# Altium schematic sheet DISPLAY.SchDoc
size A4; SheetNumber: 6; SheetTotal: 8
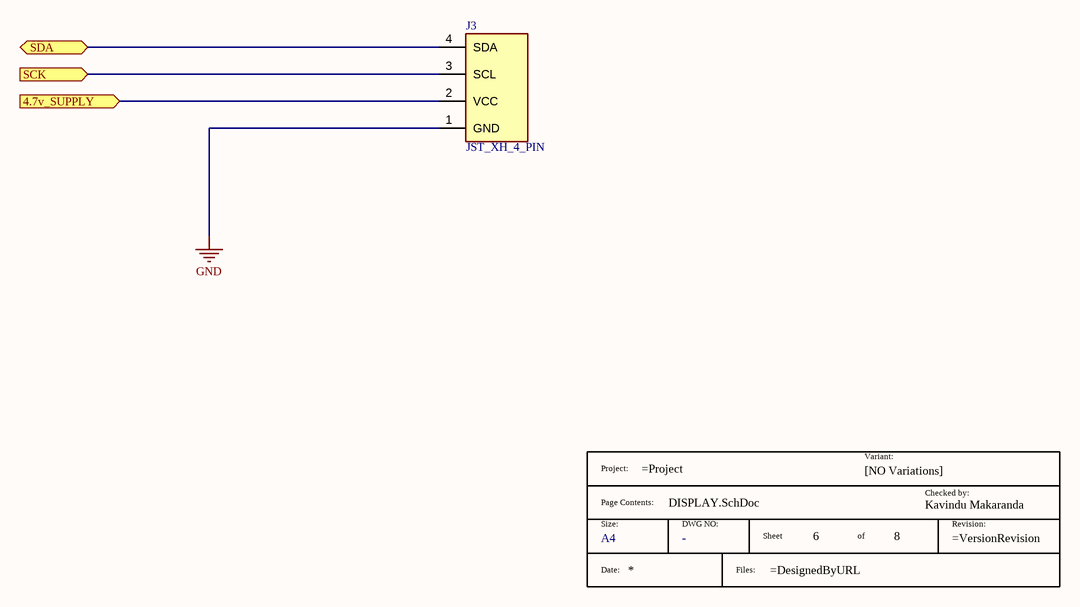
[diagram p0: DISPLAY.SchDoc]

## Parts
*?  Size: A4  (hidden comment: TitleBlock)  (graphical)
J3  JST_XH_4_PIN  [B4BXHALFSN]

## Ports
4.7v_SUPPLY (in, see Main_sch[2C], FUEL GAUGE IC[1B], MCU[3A], VOLTAGE REGULATOR[3B]), SCK (in, see Main_sch[3C], FUEL GAUGE IC[1B], MCU[1B]), SDA (bidir, see Main_sch[3C], FUEL GAUGE IC[1B], MCU[1B])

## Nets
GND: J3.1(GND)
4.7v_SUPPLY: J3.2(VCC) ; port 4.7v_SUPPLY
SCK: J3.3(SCL) ; port SCK
SDA: J3.4(SDA) ; port SDA

## Notes on the sheet
- THIS DOCUMENT AND THE DATA DISCLOSED HEREIN OR
- HEREWITH IS THE PROPERTY OF ALTIUM LIMITED AND MAY
- DWG NO:
- REVISION
- REV:
- DESCRIPTION
- DATE
- APPROVED
- BE FREELY DISTRIBUTED IN WHOLE. NO RIGHTS ARE
- RESERVED OR EXPRESS OR IMPLIED WARANTEE GIVEN.
- ENG:
- APPROVALS
- PROJECT
- DSN:
- CHK:
- REFERENCE DOCUMENTS
- PROJECT REVISION:
- TITLE
- DOCUMENT REVISION:
- DESIGN ITEM:
- BOM:
- FAB DWG:
- PCB DWG:
- ASSY DWG:
- SCALE:
- A3
- SIZE
- CAGE CODE
- FILE NAME
- DWG NO.
- SHEET
- OF
- REV
- (in symbol TitleBlock) Project:; Variant:; [NO Variations]; Checked by:; Page Contents:; Kavindu Makaranda; Size:; DWG NO:; Sheet; of; Revision:; Date:; Files:

## Library data of the parts
*? = TitleBlock: Standard Title Block; DWG NO: -
J3 = B4B-XH-A_LF__SN_: Connector; Manufacturer_Name: JST (JAPAN SOLDERLESS TERMINALS); Manufacturer_Part_Number: B4B-XH-A(LF)(SN); Datasheet Link: https://datasheet.lcsc.com/szlcsc/JST-Sales-America-B4B-XH-A-LF-SN_C144395.pdf; Height: 7mm; Mouser Part Number: 306-B4BXHALFSN; Mouser Price/Stock: https://www.mouser.co.uk/ProductDetail/JST-Commercial/B4B-XH-ALFSN?qs=cdbOS8ANM9CfC08d%252BywhFw%3D%3D; Arrow Part Number: B4B-XH-A(LF)(SN); Arrow Price/Stock: https://www.arrow.com/en/products/b4b-xh-a-lf-sn/jst-manufacturing?utm_currency=USD&region=europe; Supplier 1: Mouser; Supplier Part Number 1: 306-B4BXHALFSN